# EAGLE design Qwiic_Alphanumeric_Display (EAGLE 9.5.2)
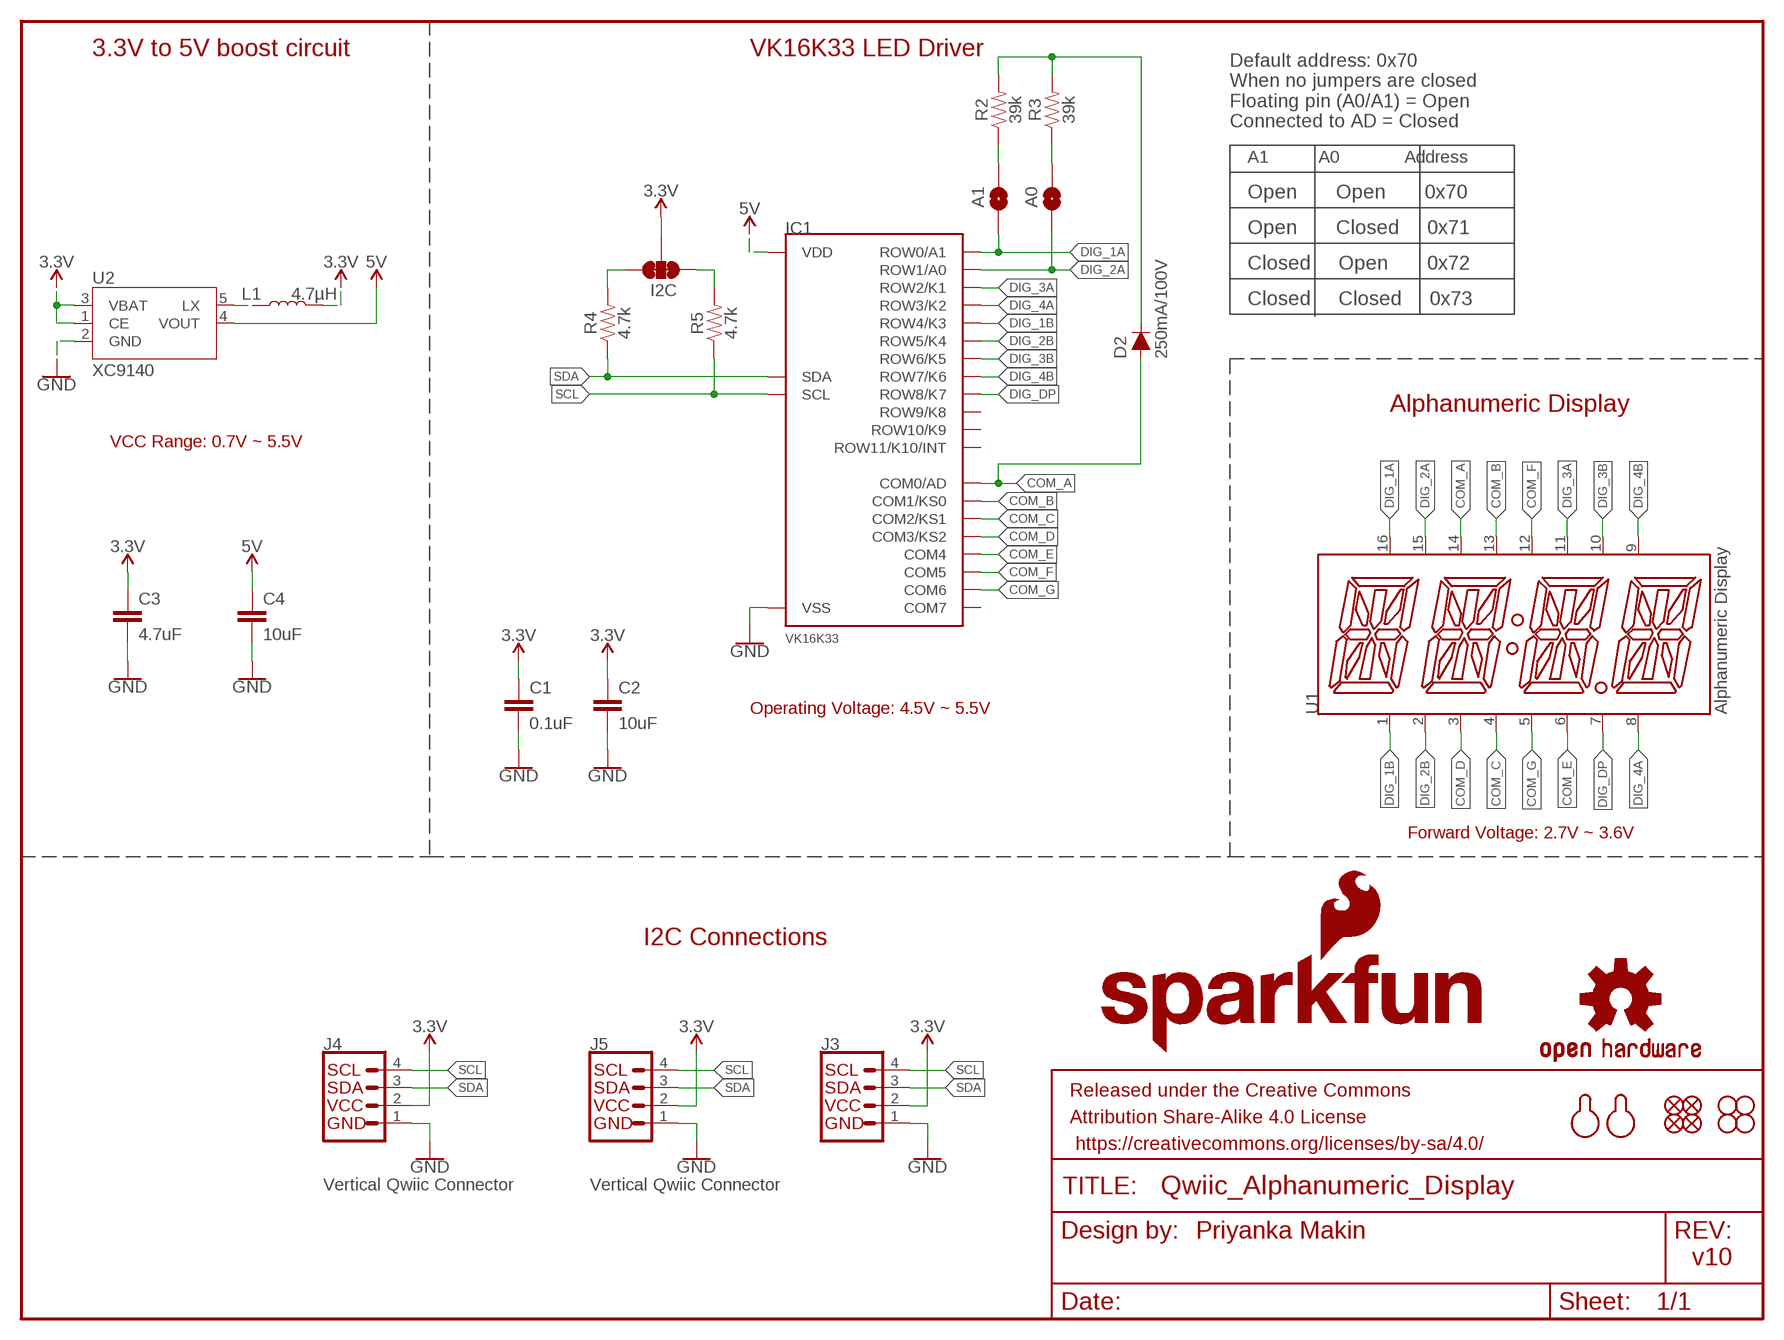
[diagram p0: schematic, sheet 1]

## Parts
A0  JUMPER-SMT_2_NO_SILK  [SMT-JUMPER_2_NO_SILK]
A1  JUMPER-SMT_2_NO_SILK  [SMT-JUMPER_2_NO_SILK]
C1  0.1uF  0.1UF-0603-25V-5%  [0603]
C2  10uF  10UF-0603-6.3V-20%  [0603]
C3  4.7uF  4.7UF-0603-6.3V-(10%)  [0603]
C4  10uF  10UF-0603-6.3V-20%  [0603]
D2  250mA/100V  DIODE-BAS16J  [SOD-323]
FD1  FIDUCIAL1X2  [FIDUCIAL-1X2]
FD2  FIDUCIAL1X2  [FIDUCIAL-1X2]
FD3  FIDUCIAL1X2  [FIDUCIAL-1X2]
FD4  FIDUCIAL1X2  [FIDUCIAL-1X2]
FRAME1  FRAME-LETTER  [CREATIVE_COMMONS]
H1  STAND-OFF  [STAND-OFF]
H2  STAND-OFF  [STAND-OFF]
H3  STAND-OFF  [STAND-OFF]
H4  STAND-OFF  [STAND-OFF]
I2C  JUMPER-SMT_3_2-NC_TRACE_NO-SILK  [SMT-JUMPER_3_2-NC_TRACE_NO-SILK]
IC1  VK16K33VK16K33  [VK16K33]
J3  I2C_STANDARD_NO_SILK  [1X04_NO_SILK]
J4  Vertical Qwiic Connector  QWIIC_CONNECTOR  [JST04_1MM_VERT]
J5  Vertical Qwiic Connector  QWIIC_CONNECTOR  [JST04_1MM_VERT]
L1  4.7µH  INDUCTOR-CDRH-4.7UH  [INDUCTOR_4.7UH]
LOGO1  OSHW-LOGOMINI  [OSHW-LOGO-MINI]
LOGO2  SFE_LOGO_NAME.1_INCH  [SFE_LOGO_NAME_.1]
LOGO3  SFE_LOGO_NAME.1_INCH  [SFE_LOGO_NAME_.1]
LOGO4  SFE_LOGO_FLAME.1_INCH  [SFE_LOGO_FLAME_.1]
R2  39k  39KOHM-0603-1/10W-1%  [0603]
R3  39k  39KOHM-0603-1/10W-1%  [0603]
R4  4.7k  4.7KOHM-0402T-1/16W-1%  [0402-TIGHT]
R5  4.7k  4.7KOHM-0402T-1/16W-1%  [0402-TIGHT]
U1  Alphanumeric Display  SILSMART_DISPLAY-PINK  [SILSMART_DISPLAY]
U2  XC9140  [SOT23-5]
U$3  MOUNTING_HOLE_M2-0.4X6  [MOUNTING_HOLE_M2-0.4X6]
U$7  MOUNTING_HOLE_M2-0.4X6  [MOUNTING_HOLE_M2-0.4X6]

## Nets
3.3V: C1.1 C2.1 C3.1 I2C.2 J3.2 J4.2 J5.2 L1.P$2 U2.1(CE) U2.3(VBAT)
5V: C4.1 IC1.24(VDD) U2.4(VOUT)
COM_A: D2.A IC1.2(COM0/AD) U1.14(COM_A)
COM_B: IC1.3(COM1/KS0) U1.13(COM_B)
COM_C: IC1.4(COM2/KS1) U1.4(COM_C)
COM_D: IC1.5(COM3/KS2) U1.3(COM_D)
COM_E: IC1.6(COM4) U1.6(COM_E)
COM_F: IC1.7(COM5) U1.12(COM_F)
COM_G: IC1.8(COM6) U1.5(COM_G1)
DIG_1A: A1.1 IC1.21(ROW0/A1) U1.16(DIG_1A)
DIG_1B: IC1.17(ROW4/K3) U1.1(DIG_1B)
DIG_2A: A0.1 IC1.20(ROW1/A0) U1.15(DIG_2A)
DIG_2B: IC1.16(ROW5/K4) U1.2(DIG_2B)
DIG_3A: IC1.19(ROW2/K1) U1.11(DIG_3A)
DIG_3B: IC1.15(ROW6/K5) U1.10(DIG_3B)
DIG_4A: IC1.18(ROW3/K2) U1.8(DIG_4A)
DIG_4B: IC1.14(ROW7/K6) U1.9(DIG_4B)
DIG_DP: IC1.13(ROW8/K7) U1.7(DIG_DP)
GND: C1.2 C2.2 C3.2 C4.2 IC1.1(VSS) J3.1 J4.1 J5.1 U2.2(GND)
N$1: I2C.3 R4.2
N$2: A1.2 R2.1
N$3: A0.2 R3.1
N$4: I2C.1 R5.2
N$6: D2.C R2.2 R3.2
N$10: L1.P$1 U2.5(LX)
SCL: IC1.22(SCL) J3.4 J4.4 J5.4 R5.1
SDA: IC1.23(SDA) J3.3 J4.3 J5.3 R4.1
Unconnected: IC1.9(COM7) IC1.10(ROW11/K10/INT) IC1.11(ROW10/K9) IC1.12(ROW9/K8)

## Notes on the sheet
- 3.3V to 5V boost circuit | VK16K33 LED Driver
- Default address: 0x70
  When no jumpers are closed
  Floating pin (A0/A1) = Open
  Connected to AD = Closed
- A1          A0             Address
- Open       Open       0x70
- Open       Closed     0x71
- Closed     Open       0x72
- Closed     Closed     0x73
- Alphanumeric Display
- VCC Range: 0.7V ~ 5.5V
- VK16K33
- Operating Voltage: 4.5V ~ 5.5V
- Forward Voltage: 2.7V ~ 3.6V
- I2C Connections
- Priyanka Makin
- v10

## Library data of the parts
A0 A1 = SparkFun-Jumpers:JUMPER-SMT_2_NO: Normally open jumper This jumper has two pads in close proximity to each other. Apply solder to close the connection. Round pads are easier to solder for beginners, but are a lot larger. SparkFun Product that uses the round pads: SparkFun EL Sequencer <https://www.sparkfun.com/products/12781>
C1 = SparkFun-Capacitors:0.1UF: 0.1µF ceramic capacitors A capacitor is a passive two-terminal electrical component used to store electrical energy temporarily in an electric field.; PROD_ID: CAP-08604
C2 C4 = SparkFun-Capacitors:10UF: 10.0µF ceramic capacitors A capacitor is a passive two-terminal electrical component used to store electrical energy temporarily in an electric field.; PROD_ID: CAP-11015
C3 = SparkFun-Capacitors:4.7UF: 4.7µF ceramic capacitors A capacitor is a passive two-terminal electrical component used to store electrical energy temporarily in an electric field.; PROD_ID: CAP-08280
D2 = SparkFun-DiscreteSemi:DIODE: Diode These are standard reverse protection diodes and small signal diodes. SparkFun Products: SparkFun SparkPunk Sound Kit <https://www.sparkfun.com/products/11177> SparkFun ESP8266 Thing <https://www.sparkfun.com/products/13231>; PROD_ID: DIO-09646
FD1-FD4 = SparkFun-Aesthetics:FIDUCIAL: Fiducial Alignment Points Point-of-reference for pick-and-place machines and other optical instruments.
FRAME1 = SparkFun-Aesthetics:FRAME-LETTER: Schematic Frame - Letter Standard 8.5x11 US Letter frame
H1-H4 = SparkFun-Hardware:STAND-OFF: Stand Off Drill holes for mechanically mounting via screws, standoffs, etc. Note: Use the keepout ring to avoid running the screw head into surrounding components. Variant Overviews STAND-OFF - Mechanical footprint for a #4 phillips button head screw. STAND-OFF-TIGHT - Mechanical footprint for a #4 phillips button head screw, Example SparkFun Products Screw - Phillips Head (1/4", 4-40, 10 pack) <https://www.sparkfun.com/products/10453> (PRT-10453) Screw - Phillips Head (1/2", 4-40, 10 pack) <https://www.sparkfun.com/products/10452> (PRT-10452) Screw - Phillips Head (3/4", 4-40, 10 pack) <https://www.sparkfun.com/products/10451> (PRT-10451) Screw - Phillips Head (1", 4-40, 10 pack) <https://www.sparkfun.com/products/10450> (PRT-10450)
I2C = SparkFun-Jumpers:JUMPER-SMT_3_2-NC_TRACE: Normally closed trace jumper (2 of 2 connections) This jumper has a trace between all three pads so they are normally closed (NC). Use a razor knife to open the connection(s). For best results follow the IPC guidelines for cutting traces: Cutout at least 0.063 mm (0.005 in). Remove all loose material to clean up the cut area. Seal the cut with an approved epoxy. Reapply solder to reclose the connection(s).
IC1 = Alphanumeric_Display_Library:VK16K33: HT16K33 24 SOP-A : RAM Mapping 16x8 LED Controller Driver with Keyscan; PROD_ID: IC-16176
J3 = SparkFun-Connectors:I2C_STANDARD: SparkFun I2C Standard Pinout Header SparkFun has standardized on a pinout for all I2C based sensor breakouts. This pinout allows I2C boards to be plugged directly into the headers on Arduino Uno compatible boards, and to be daisy chained easily. Example SparkFun Products: SparkFun Atmospheric Sensor Breakout - BME280 <https://www.sparkfun.com/products/13676> SparkFun Altitude/Pressure Sensor Breakout - MPL3115A2 <https://www.sparkfun.com/products/11084> SparkFun TOF Range Finder Sensor - VL6180 <https://www.sparkfun.com/products/12785>
J4 J5 = SparkFun-Connectors:QWIIC_CONNECTOR: SparkFun I2C Standard Qwiic Connector An SMD 1mm pitch JST connector makes it easy and quick (get it? Qwiic?) to connect I2C devices to each other. The Qwiic system <http://www.sparkfun.com/qwiic> enables fast and solderless connection between popular platforms and various sensors and actuators. We carry 200mm <https://www.sparkfun.com/products/14204>, 100mm <https://www.sparkfun.com/products/14205>, 50mm <https://www.sparkfun.com/products/14206>, and breadboard friendly <https://www.sparkfun.com/products/14207> Qwiic cables. We also offer 10 pcs strips <https://www.sparkfun.com/products/14323> the SMD connectors.; PROD_ID: CONN-14483
L1 = SparkFun-Coils:INDUCTOR: Inductors Resist changes in electrical current. Basically a coil of wire. SparkFun Products: SparkFun Load Cell Amplifier - HX711 <https://www.sparkfun.com/products/13879> IOIO-OTG - V2.2 <https://www.sparkfun.com/products/13613>; PROD_ID: NDUC-10146; VALUE: 4.7µH/±30%/1.2A
LOGO1 = SparkFun-Aesthetics:OSHW-LOGO: Open-Source Hardware (OSHW) Logo This logo indicates the piece of hardware it is found on incorporates a OSHW license and/or adheres to the definition of open source hardware found here: http://freedomdefined.org/OSHW
LOGO2 LOGO3 = SparkFun-Aesthetics:SFE_LOGO_NAME: SparkFun Font Logo This is the SparkFun name logo. The logo on the schematic will always be the same size; the package variant is the height of the flame part of the logo (or the height the flame would be, if it were drawn). Default layer for the logo on the board is tSilk.
LOGO4 = SparkFun-Aesthetics:SFE_LOGO_FLAME: SparkFun Flame Logo This is the SparkFun flame logo. The logo on the schematic will always be the same size; the package variant is the height of the flame. Default layer for the logo on the board is tSilk.
R2 R3 = SparkFun-Resistors:39KOHM: 39kΩ resistor A resistor is a passive two-terminal electrical component that implements electrical resistance as a circuit element. Resistors act to reduce current flow, and, at the same time, act to lower voltage levels within circuits. - Wikipedia; PROD_ID: RES-12377
R4 R5 = SparkFun-Resistors:4.7KOHM: 4.7kΩ resistor A resistor is a passive two-terminal electrical component that implements electrical resistance as a circuit element. Resistors act to reduce current flow, and, at the same time, act to lower voltage levels within circuits. - Wikipedia; PROD_ID: RES-15343
U1 = SparkFun-Displays:SILSMART_DISPLAY: 14-Segment Alphanumeric LED Display from Silsmart Optoelectronics; PROD_ID: COMP-14892
U2 = SparkFun-IC-Power:XC9140: Simple 100mA max DC boost requiring only 3 external components. Useful for converting 3.3V or 4.2V up to 5V. 5.5V max output.; PROD_ID: VREG-14648
U$3 U$7 = Alphanumeric_Display_Library:MOUNTING_HOLE_M2-0.4X6

## Board
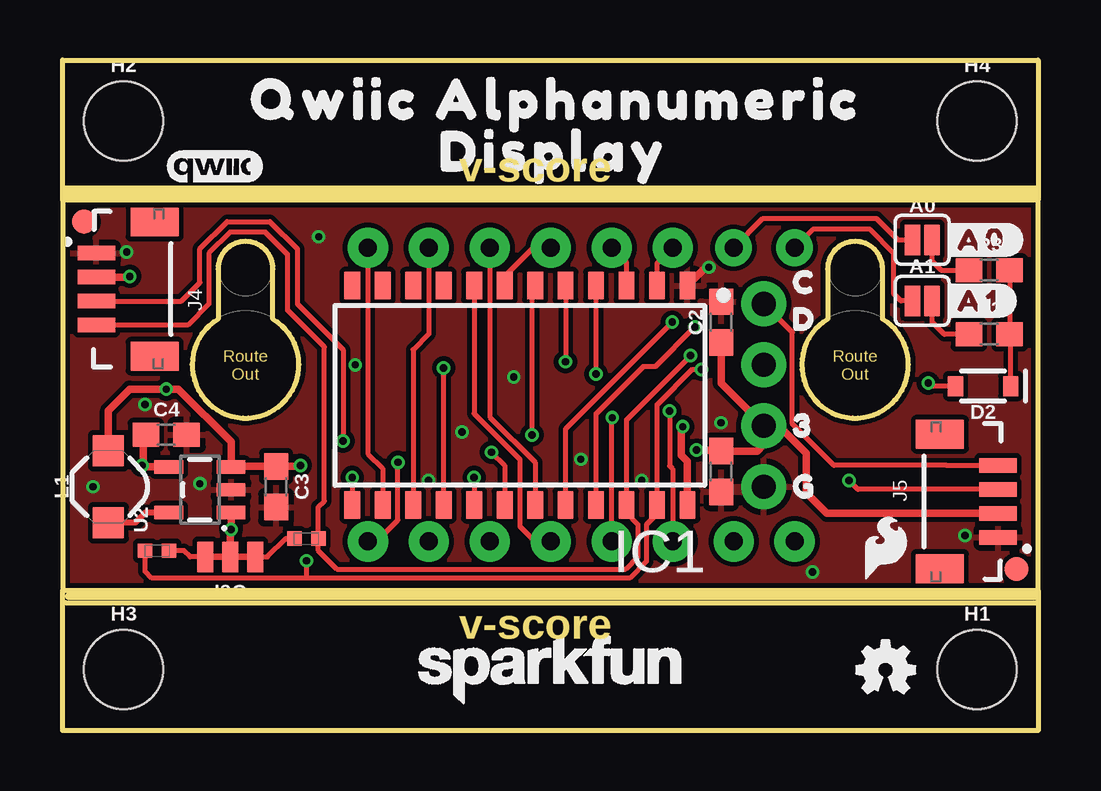
[diagram p1: board, top side]
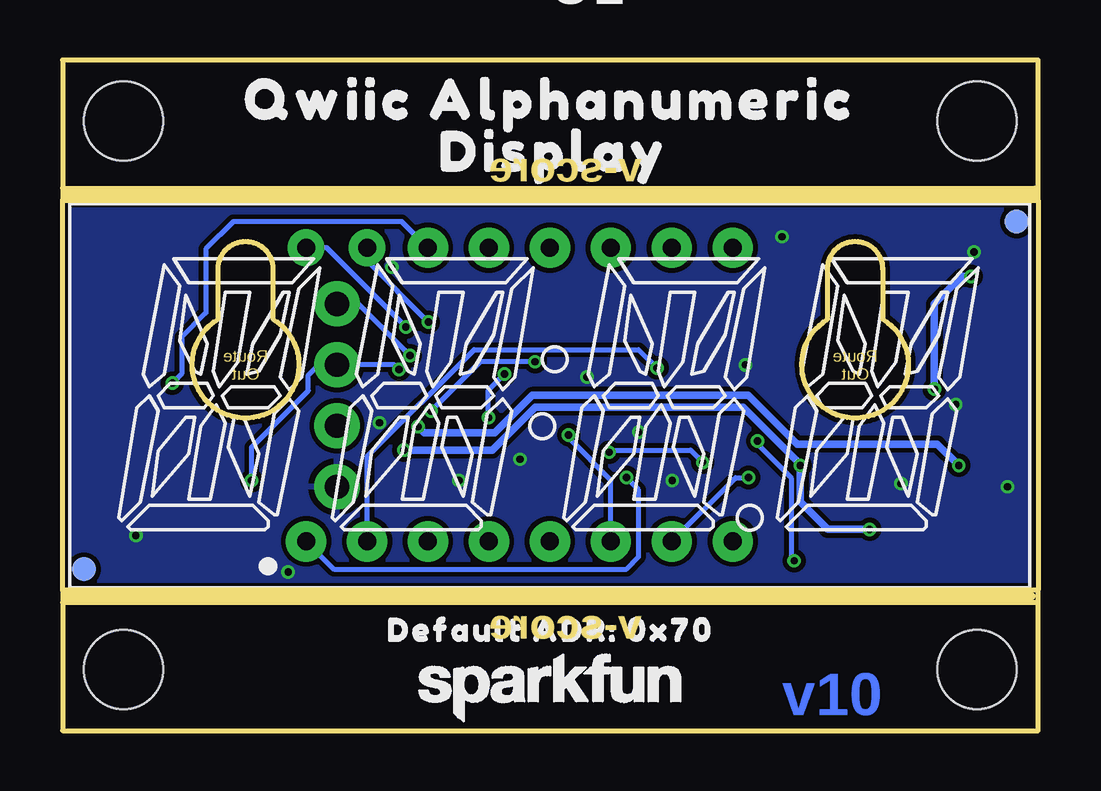
[diagram p2: board, bottom side, seen from below]

Size 40.64 x 27.94 mm. Coordinates in mm from the lower left corner, seen from the top.
Outline: 0,5.84 40.64,5.84
Outline: 40.64,5.84 40.64,22.1
Outline: 40.64,22.1 0,22.1
Outline: 0,22.1 0,5.84
Outline: 0,22.1 0,27.94 40.64,27.94 40.64,22.1
Outline: 40.64,5.84 40.64,0 0,0 0,5.84
Outline: 40.64,22.61 0.13,22.61
Outline: 0.13,5.33 40.64,5.33
Copper layers (1*16): Top 0.035mm / dielectric 1.5mm / Bottom 0.035mm
Design rules "SparkFun-2-Layer-Minimum-JLCPCB": minimum track width 5mil, minimum drill 0.3mm, track to track 5mil, track to pad 5mil, pad to pad 5mil, via to via 5mil, smd to smd 5mil, copper to edge 7mil, drill to drill 7mil, minimum pad ring 5mil, minimum via ring 5mil, stop-mask expansion 2.5mil, vias tented up to drill 25mil, thermal gap 10mil
Milling: 2 lines

### Footprints (pad centres in the part's own frame; a part is rotated, then mirrored left to right if it is on the bottom)
SMT-JUMPER_2_NO_SILK = smd 0.635 x 1.27: 1 -0.406,0; 2 0.406,0
0603 = smd 1.1 x 1: 1 -0.85,0; 2 0.85,0
SOD-323 = smd 0.63 x 0.83: A 1.15,0; C -1.15,0
FIDUCIAL-1X2 = smd 1 x 1: 1 0,0
STAND-OFF = hole 3.302: 0,0
SMT-JUMPER_3_2-NC_TRACE_NO-SILK = smd 0.66 x 1.27: 1 -1.041,0; 2 0,0; 3 1.041,0
VK16K33 = smd 0.66 x 1.143: 1 -6.985,-4.572; 2 -5.715,-4.572; 3 -4.445,-4.572; 4 -3.175,-4.572; 5 -1.905,-4.572; 6 -0.635,-4.572; 7 0.635,-4.572; 8 1.905,-4.572; 9 3.175,-4.572; 10 4.445,-4.572; 11 5.715,-4.572; 12 6.985,-4.572; 13 6.985,4.572; 14 5.715,4.572; 15 4.445,4.572; 16 3.175,4.572; 17 1.905,4.572; 18 0.635,4.572; 19 -0.635,4.572; 20 -1.905,4.572; 21 -3.175,4.572; 22 -4.445,4.572; 23 -5.715,4.572; 24 -6.985,4.572
1X04_NO_SILK = drill 1.016 pad 1.88: 1 0,0; 2 2.54,0; 3 5.08,0; 4 7.62,0
JST04_1MM_VERT = smd 0.6 x 1.55: 1 -1.478,0.775; 2 -0.478,0.775; 3 0.522,0.775; 4 1.522,0.775 | smd 1.2 x 2: NC1 -2.778,3.2; NC2 2.822,3.2
INDUCTOR_4.7UH = smd 1.3 x 1.3: P$1 -1.5,0; P$2 1.5,0
0402-TIGHT = smd 0.6 x 0.6: 1 -0.5,0; 2 0.5,0
SILSMART_DISPLAY = drill 0.75 pad 1.676: 1 -10.178,-6.092; 2 -7.638,-6.092; 3 -5.098,-6.092; 4 -2.558,-6.092; 5 -0.018,-6.092; 6 2.522,-6.092; 7 5.062,-6.092; 8 7.602,-6.092; 9 7.602,6.148; 10 5.062,6.148; 11 2.522,6.148; 12 -0.018,6.148; 13 -2.558,6.148; 14 -5.098,6.148 | drill 0.75 pad 1.524: 15 -7.638,6.148; 16 -10.178,6.148
SOT23-5 = smd 0.55 x 1.2: 1 -0.95,-1.3; 2 0,-1.3; 3 0.95,-1.3; 4 0.95,1.3; 5 -0.95,1.3

### Placement (x,y rotation side)
A0  35.81,20.45 0 top
A1  35.81,17.91 0 top
C1  27.43,10.79 270 top
C2  27.43,17.02 90 top
C3  8.89,10.16 270 top
C4  4.32,12.32 0 top
D2  38.35,14.35 180 top
FD1  0.89,21.21 0 top
FD2  0.89,21.21 0 bottom
FD3  39.75,6.73 0 top
FD4  39.75,6.73 0 bottom
FRAME1  -1.27,-8.89 0 top  (outside the outline)
H1  38.1,2.54 0 top
H2  2.54,25.4 0 top
H3  2.54,2.54 0 top
H4  38.1,25.4 0 top
I2C  6.99,7.24 180 top
IC1  19.05,13.97 180 top
J3  29.21,10.16 90 top
J4  0.64,18.41 270 top
J5  39.75,9.53 90 top
L1  1.91,10.16 90 top
LOGO1  34.29,2.54 0 top
LOGO2  20.32,1.78 0 bottom
LOGO3  20.32,2.54 0 top
LOGO4  34.29,7.62 0 top
R2  38.61,16.51 0 top
R3  38.61,19.18 0 top
R4  3.94,7.49 0 top
R5  10.16,8 180 top
U1  20.32,13.97 0 bottom
U2  5.71,10.03 90 top
U$1  [DEFAULT_ADR#_0X700]  27.81,4.19 0 bottom
U$3  33.02,15.24 0 top
U$6  [QWIIC_4MM]  6.35,23.5 0 top
U$7  7.62,15.24 0 top
U$8  [QWIIC_ALPHANUMERIC0]  6.6,26.29 0 top
U$9  [QWIIC_ALPHANUMERIC0]  34.29,26.29 0 bottom
U$10  [DISPLAY0]  14.48,24.13 0 top
U$11  [DISPLAY0]  26.16,24.13 0 bottom
U$12  [#A0#0]  36.58,20.45 0 top
U$13  [#A1#0]  36.58,17.91 0 top
U$14  [C0]  29.72,18.67 0 top
U$15  [D0]  29.72,17.14 0 top
U$16  [30]  29.72,12.7 0 top
U$17  [G0]  29.72,10.16 0 top

### Tracks (layer width: path | path; a pad name or v marks a point on that pad's centre or on a via)
3.3V  (via drill 0.3)
  Top 0.203: 2.76,18.89 v2.79,18.92
  Top 0.305: J3.2 29.84,12.7 30.99,11.56 30.99,9.91 31.85,9.05 J5.2 | J4.2 2.76,18.89 | J3.2 27.43,14.48 C2.1 | U2.1 v7.01,8.38 6.99,8.35 I2C.2 | L1.P$2 1.91,13.34 2.79,14.22 v4.32,14.22 4.83,14.22 7.01,12.04 U2.3 7.04,11.01 C3.1 9.87,11.01 v9.91,11.05 | v26.42,11.68 27.39,11.68 C1.1 28.93,11.64 29.21,11.92 J3.2
  Bottom 0.305: v26.42,11.68 22.73,11.68 20.95,13.46 12.28,13.46 9.91,11.09 v9.91,11.05 9.91,9.53 8.76,8.38 v7.01,8.38 | v2.79,18.92 3.17,18.92 4.32,17.78 v4.32,14.22
5V  (via drill 0.3)
  Top 0.203: 3.37,10.98 v3.3,11.05
  Top 0.305: U2.4 3.37,10.98 3.37,12.22 C4.1 | IC1.24 26.04,11.22 25.78,11.47 25.78,12.61 v25.84,12.66
  Bottom 0.305: v3.3,11.05 4.19,11.94 10.03,11.94 12.06,13.97 21.08,13.97 22.64,12.41 25.58,12.41 v25.84,12.66
COM_A  (via drill 0.3)
  Top 0.203: IC1.2 24.77,19.46 U1.14 | D2.A 36.2,14.35 v36.07,14.48
  Bottom 0.203: U1.14 26.51,21.21 33.53,21.21 34.67,20.07 34.67,17.4 35.69,16.38 35.69,14.86 v36.07,14.48
COM_B
  Top 0.203: IC1.3 23.5,19.5 U1.13
COM_C  (via drill 0.3)
  Top 0.203: v22.23,14.86 IC1.4 | U1.4 22.88,13.02 v22.9,13.04
  Bottom 0.203: v22.9,13.04 22.9,14.19 v22.23,14.86
COM_D  (via drill 0.3)
  Top 0.203: IC1.5 v20.95,15.37 | v25.29,13.32 25.29,11.03 25.42,10.9 U1.3
  Bottom 0.203: v20.95,15.37 23.24,15.37 v25.29,13.32
COM_E  (via drill 0.3)
  Top 0.203: v19.56,12.32 19.56,18.41 IC1.6
  Bottom 0.203: U1.6 17.8,10.43 19.56,12.19 v19.56,12.32
COM_F
  Top 0.203: IC1.7 18.41,18.92 19.61,20.12 U1.12
COM_G
  Top 0.203: IC1.8 17.14,13.21 19.05,11.3 19.05,8.51 19.68,7.88 U1.5
DIG_1A  (via drill 0.3)
  Top 0.203: A1.1 34.92,17.91 34.64,18.2 34.64,19.89 33.64,20.88 31.26,20.88 U1.16 | IC1.21 22.23,13.21 24.18,15.16 24.69,15.16 v26.34,16.82
  Bottom 0.203: v26.34,16.82 29.64,20.12 U1.16
DIG_1B  (via drill 0.3)
  Top 0.203: v17.14,10.54 IC1.17
  Bottom 0.203: U1.1 29.35,6.73 17.14,6.73 16.64,7.24 16.64,10.03 v17.14,10.54
DIG_2A  (via drill 0.3)
  Top 0.203: U1.15 29.18,21.34 33.91,21.34 34.8,20.45 A0.1 | IC1.20 20.95,12.57 v25.4,17.02
  Bottom 0.203: v25.4,17.02 27.96,19.58 U1.15
DIG_2B  (via drill 0.3)
  Top 0.203: IC1.16 v15.88,15.11
  Bottom 0.203: v15.88,15.11 16.64,15.88 23.5,15.88 27.94,11.43 27.94,7.9 U1.2
DIG_3A
  Top 0.203: U1.11 17.8,13.06 19.68,11.18 IC1.19
DIG_3B
  Top 0.203: U1.10 15.26,16.53 14.61,15.88 IC1.15
DIG_4A  (via drill 0.3)
  Top 0.203: U1.8 13.09,7.88 13.97,8.76 v13.97,11.18 | v17.87,11.6 18.41,11.05 IC1.18
  Bottom 0.203: v13.97,11.18 14.48,11.68 17.78,11.68 v17.87,11.6
DIG_4B
  Top 0.203: U1.9 12.72,11.54 13.34,10.92 IC1.14
DIG_DP  (via drill 0.3)
  Top 0.203: v12.06,10.54 IC1.13
  Bottom 0.203: U1.7 12.6,10.54 v12.06,10.54
GND  (via drill 0.3)
  Top 0.305: IC1.1 26.8,19.3 v26.92,19.3
  other vias: 10.67,20.57 27.43,12.83 1.27,10.16 31.24,6.6 12.19,15.24 3.43,13.59 5.71,10.29 18.8,14.73 37.59,8.13 2.67,19.94 16.64,12.45 21.59,11.3 15.24,10.41 24.13,10.41
  pour Top (isolate 0.203): 0,5.84 0,22.1 40.64,22.1 40.64,5.84
  pour Bottom (isolate 0.203): 0,22.1 40.64,22.1 40.64,5.84 0,5.84
N$1
  Top 0.203: I2C.3 5.31,7.24 5.05,7.49 R4.2
N$2
  Top 0.203: A1.2 36.22,17.03 36.74,16.51 R2.1
N$3
  Top 0.203: R3.1 36.62,19.18 36.22,19.57 A0.2
N$4
  Top 0.203: I2C.1 8.53,7.24 9.3,8 R5.2
N$6
  Top 0.203: R3.2 R2.2 39.5,16.51 D2.C
N$10
  Top 0.254: L1.P$1 3.03,8.66 3.45,9.08 U2.5
SCL  (via drill 0.3)
  Top 0.203: J3.4 30.4,16.59 30.4,12.78 32.13,11.05 36.83,11.05 J5.4 | v26.16,15.62 23.5,12.95 IC1.22 23.5,9.06 23.97,8.58 23.97,7.24 23.46,6.73 11.42,6.73 10.66,7.49 R5.1 10.66,9.32 10.9,9.56 10.9,15.98 9.36,17.53 9.36,19.85 8.45,20.76 6.98,20.76 6.1,19.88 6.1,17.78 5.21,16.89 J4.4
  Bottom 0.203: v26.16,15.62 28.32,17.78 J3.4
SDA  (via drill 0.3)
  Top 0.203: J5.3 33.13,10.05 v32.77,10.41 | 10.16,6.35 23.62,6.35 24.33,7.05 24.33,8.58 24.77,9.02 IC1.23 24.77,13.58 26.24,15.05 v26.62,15.05 | 10.16,6.35 3.72,6.35 3.44,6.63 R4.1 | J4.3 4.94,17.89 5.71,18.67 5.71,20.07 6.86,21.21 8.64,21.21 9.78,20.07 9.78,17.78 11.68,15.88 v11.68,12.06 | v10.16,7.07 10.16,6.35
  Bottom 0.203: v26.62,15.05 26.81,15.24 J3.3 29.97,15.24 30.4,14.81 30.4,14.16 32.77,11.8 v32.77,10.41 | v11.68,12.06 11.68,11.94 10.29,10.54 10.29,7.2 v10.16,7.07

### Text on the board
Bottom: v10
Dimension: v-score | v-score
Measures: All measures in inches
tDocu: Priyanka Makin
_tNames: I2C
_bNames: U1